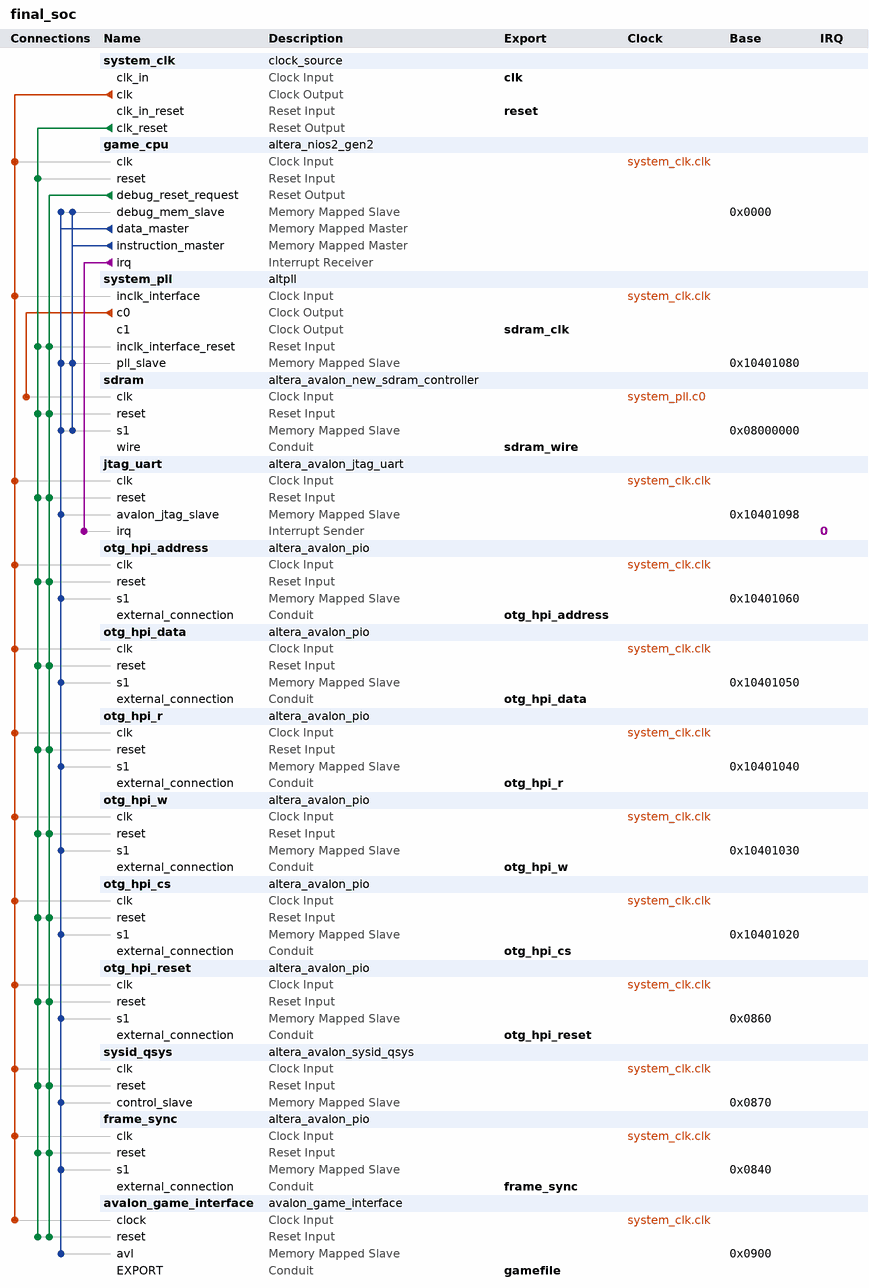
[diagram p0: system contents]
# Platform Designer (Qsys) system final_soc, Cyclone IV E EP4CE115F29C7
# Parameters at their usual value, and those the tool derives, are not listed.
package require -exact qsys 18.0
create_system final_soc
set_project_property DEVICE_FAMILY {Cyclone IV E}
set_project_property DEVICE EP4CE115F29C7

add_instance system_clk clock_source 18.0
set_instance_parameter_value system_clk clockFrequency 50000000

add_instance game_cpu altera_nios2_gen2 18.0
set_instance_parameter_value game_cpu dcache_size 2048
set_instance_parameter_value game_cpu exceptionSlave sdram.s1
set_instance_parameter_value game_cpu icache_size 4096
set_instance_parameter_value game_cpu impl Tiny
set_instance_parameter_value game_cpu resetSlave sdram.s1

add_instance system_pll altpll 18.0
set_instance_parameter_value system_pll CLK0_DIVIDE_BY 1
set_instance_parameter_value system_pll CLK0_MULTIPLY_BY 1
set_instance_parameter_value system_pll CLK1_DIVIDE_BY 1
set_instance_parameter_value system_pll CLK1_DUTY_CYCLE 50
set_instance_parameter_value system_pll CLK1_MULTIPLY_BY 1
set_instance_parameter_value system_pll CLK1_PHASE_SHIFT -3000
set_instance_parameter_value system_pll INCLK0_INPUT_FREQUENCY 20000
set_instance_parameter_value system_pll PORT_ARESET PORT_UNUSED
set_instance_parameter_value system_pll PORT_LOCKED PORT_UNUSED
set_instance_parameter_value system_pll PORT_clk1 PORT_USED
set_instance_parameter_value system_pll PORT_clk2 PORT_UNUSED
set_instance_parameter_value system_pll PORT_clk3 PORT_UNUSED

add_instance sdram altera_avalon_new_sdram_controller 18.0
set_instance_parameter_value sdram TAC 5.5
set_instance_parameter_value sdram TRCD 20.0
set_instance_parameter_value sdram TRP 20.0
set_instance_parameter_value sdram casLatency 3
set_instance_parameter_value sdram columnWidth 10
set_instance_parameter_value sdram dataWidth 32
set_instance_parameter_value sdram generateSimulationModel false
set_instance_parameter_value sdram model single_Micron_MT48LC4M32B2_7_chip
set_instance_parameter_value sdram numberOfBanks 4
set_instance_parameter_value sdram numberOfChipSelects 1
set_instance_parameter_value sdram powerUpDelay 200.0
set_instance_parameter_value sdram refreshPeriod 7.8125
set_instance_parameter_value sdram rowWidth 13

add_instance jtag_uart altera_avalon_jtag_uart 18.0
set_instance_parameter_value jtag_uart simInteractiveOptions NO_INTERACTIVE_WINDOWS

add_instance otg_hpi_address altera_avalon_pio 18.0
set_instance_parameter_value otg_hpi_address direction Output
set_instance_parameter_value otg_hpi_address width 2

add_instance otg_hpi_data altera_avalon_pio 18.0
set_instance_parameter_value otg_hpi_data direction InOut
set_instance_parameter_value otg_hpi_data width 16

add_instance otg_hpi_r altera_avalon_pio 18.0
set_instance_parameter_value otg_hpi_r direction Output
set_instance_parameter_value otg_hpi_r width 1

add_instance otg_hpi_w altera_avalon_pio 18.0
set_instance_parameter_value otg_hpi_w direction Output
set_instance_parameter_value otg_hpi_w width 1

add_instance otg_hpi_cs altera_avalon_pio 18.0
set_instance_parameter_value otg_hpi_cs direction Output
set_instance_parameter_value otg_hpi_cs width 1

add_instance otg_hpi_reset altera_avalon_pio 18.0
set_instance_parameter_value otg_hpi_reset direction Output
set_instance_parameter_value otg_hpi_reset width 1

add_instance sysid_qsys altera_avalon_sysid_qsys 18.0
set_instance_parameter_value sysid_qsys id 0

add_instance frame_sync altera_avalon_pio 18.0
set_instance_parameter_value frame_sync direction Input
set_instance_parameter_value frame_sync width 1

add_instance avalon_game_interface avalon_game_interface 1.0

# connections
add_connection system_clk.clk avalon_game_interface.clock clock
add_connection system_clk.clk frame_sync.clk clock
add_connection system_clk.clk game_cpu.clk clock
add_connection system_clk.clk jtag_uart.clk clock
add_connection system_clk.clk otg_hpi_address.clk clock
add_connection system_clk.clk otg_hpi_cs.clk clock
add_connection system_clk.clk otg_hpi_data.clk clock
add_connection system_clk.clk otg_hpi_r.clk clock
add_connection system_clk.clk otg_hpi_reset.clk clock
add_connection system_clk.clk otg_hpi_w.clk clock
add_connection system_clk.clk sysid_qsys.clk clock
add_connection system_clk.clk system_pll.inclk_interface clock
add_connection system_pll.c0 sdram.clk clock
add_connection game_cpu.debug_reset_request avalon_game_interface.reset reset
add_connection game_cpu.debug_reset_request frame_sync.reset reset
add_connection game_cpu.debug_reset_request jtag_uart.reset reset
add_connection game_cpu.debug_reset_request otg_hpi_address.reset reset
add_connection game_cpu.debug_reset_request otg_hpi_cs.reset reset
add_connection game_cpu.debug_reset_request otg_hpi_data.reset reset
add_connection game_cpu.debug_reset_request otg_hpi_r.reset reset
add_connection game_cpu.debug_reset_request otg_hpi_reset.reset reset
add_connection game_cpu.debug_reset_request otg_hpi_w.reset reset
add_connection game_cpu.debug_reset_request sdram.reset reset
add_connection game_cpu.debug_reset_request sysid_qsys.reset reset
add_connection game_cpu.debug_reset_request system_pll.inclk_interface_reset reset
add_connection system_clk.clk_reset avalon_game_interface.reset reset
add_connection system_clk.clk_reset frame_sync.reset reset
add_connection system_clk.clk_reset game_cpu.reset reset
add_connection system_clk.clk_reset jtag_uart.reset reset
add_connection system_clk.clk_reset otg_hpi_address.reset reset
add_connection system_clk.clk_reset otg_hpi_cs.reset reset
add_connection system_clk.clk_reset otg_hpi_data.reset reset
add_connection system_clk.clk_reset otg_hpi_r.reset reset
add_connection system_clk.clk_reset otg_hpi_reset.reset reset
add_connection system_clk.clk_reset otg_hpi_w.reset reset
add_connection system_clk.clk_reset sdram.reset reset
add_connection system_clk.clk_reset sysid_qsys.reset reset
add_connection system_clk.clk_reset system_pll.inclk_interface_reset reset
add_connection game_cpu.data_master avalon_game_interface.avl avalon
set_connection_parameter_value game_cpu.data_master/avalon_game_interface.avl baseAddress 0x0900
add_connection game_cpu.data_master frame_sync.s1 avalon
set_connection_parameter_value game_cpu.data_master/frame_sync.s1 baseAddress 0x0840
add_connection game_cpu.data_master game_cpu.debug_mem_slave avalon
set_connection_parameter_value game_cpu.data_master/game_cpu.debug_mem_slave baseAddress 0x0000
add_connection game_cpu.data_master jtag_uart.avalon_jtag_slave avalon
set_connection_parameter_value game_cpu.data_master/jtag_uart.avalon_jtag_slave baseAddress 0x10401098
add_connection game_cpu.data_master otg_hpi_address.s1 avalon
set_connection_parameter_value game_cpu.data_master/otg_hpi_address.s1 baseAddress 0x10401060
add_connection game_cpu.data_master otg_hpi_cs.s1 avalon
set_connection_parameter_value game_cpu.data_master/otg_hpi_cs.s1 baseAddress 0x10401020
add_connection game_cpu.data_master otg_hpi_data.s1 avalon
set_connection_parameter_value game_cpu.data_master/otg_hpi_data.s1 baseAddress 0x10401050
add_connection game_cpu.data_master otg_hpi_r.s1 avalon
set_connection_parameter_value game_cpu.data_master/otg_hpi_r.s1 baseAddress 0x10401040
add_connection game_cpu.data_master otg_hpi_reset.s1 avalon
set_connection_parameter_value game_cpu.data_master/otg_hpi_reset.s1 baseAddress 0x0860
add_connection game_cpu.data_master otg_hpi_w.s1 avalon
set_connection_parameter_value game_cpu.data_master/otg_hpi_w.s1 baseAddress 0x10401030
add_connection game_cpu.data_master sdram.s1 avalon
set_connection_parameter_value game_cpu.data_master/sdram.s1 baseAddress 0x08000000
add_connection game_cpu.data_master sysid_qsys.control_slave avalon
set_connection_parameter_value game_cpu.data_master/sysid_qsys.control_slave baseAddress 0x0870
add_connection game_cpu.data_master system_pll.pll_slave avalon
set_connection_parameter_value game_cpu.data_master/system_pll.pll_slave baseAddress 0x10401080
add_connection game_cpu.instruction_master game_cpu.debug_mem_slave avalon
set_connection_parameter_value game_cpu.instruction_master/game_cpu.debug_mem_slave baseAddress 0x0000
add_connection game_cpu.instruction_master sdram.s1 avalon
set_connection_parameter_value game_cpu.instruction_master/sdram.s1 baseAddress 0x08000000
add_connection game_cpu.instruction_master system_pll.pll_slave avalon
set_connection_parameter_value game_cpu.instruction_master/system_pll.pll_slave baseAddress 0x10401080
add_connection game_cpu.irq jtag_uart.irq interrupt
set_connection_parameter_value game_cpu.irq/jtag_uart.irq irqNumber 0

# exported interfaces
add_interface clk clock sink
set_interface_property clk EXPORT_OF system_clk.clk_in
add_interface frame_sync conduit end
set_interface_property frame_sync EXPORT_OF frame_sync.external_connection
add_interface gamefile conduit end
set_interface_property gamefile EXPORT_OF avalon_game_interface.EXPORT
add_interface otg_hpi_address conduit end
set_interface_property otg_hpi_address EXPORT_OF otg_hpi_address.external_connection
add_interface otg_hpi_cs conduit end
set_interface_property otg_hpi_cs EXPORT_OF otg_hpi_cs.external_connection
add_interface otg_hpi_data conduit end
set_interface_property otg_hpi_data EXPORT_OF otg_hpi_data.external_connection
add_interface otg_hpi_r conduit end
set_interface_property otg_hpi_r EXPORT_OF otg_hpi_r.external_connection
add_interface otg_hpi_reset conduit end
set_interface_property otg_hpi_reset EXPORT_OF otg_hpi_reset.external_connection
add_interface otg_hpi_w conduit end
set_interface_property otg_hpi_w EXPORT_OF otg_hpi_w.external_connection
add_interface reset reset sink
set_interface_property reset EXPORT_OF system_clk.clk_in_reset
add_interface sdram_clk clock source
set_interface_property sdram_clk EXPORT_OF system_pll.c1
add_interface sdram_wire conduit end
set_interface_property sdram_wire EXPORT_OF sdram.wire

set_interconnect_requirement {$system} qsys_mm.clockCrossingAdapter HANDSHAKE
set_interconnect_requirement {$system} qsys_mm.enableEccProtection FALSE
set_interconnect_requirement {$system} qsys_mm.insertDefaultSlave FALSE
set_interconnect_requirement {$system} qsys_mm.maxAdditionalLatency 1

save_system final_soc.qsys
